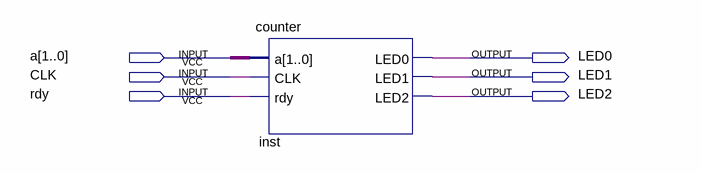
[diagram p0: schematic sheet]
// Quartus schematic Block1.bdf as structural Verilog: 1 symbols, 6 pins
module Block1 (
  input  [1:0] a,
  input  CLK,
  input  rdy,
  output LED0,
  output LED1,
  output LED2
);

  counter inst (.a(a), .CLK(CLK), .rdy(rdy), .LED0(LED0), .LED1(LED1), .LED2(LED2));
endmodule
